# Altium schematic sheet HF_AMP_DRIVER.SchDoc: HF RF AMP DRIVER
size A4; DocumentNumber: 17; Revision: 2.0; SheetNumber: 17; SheetTotal: 18
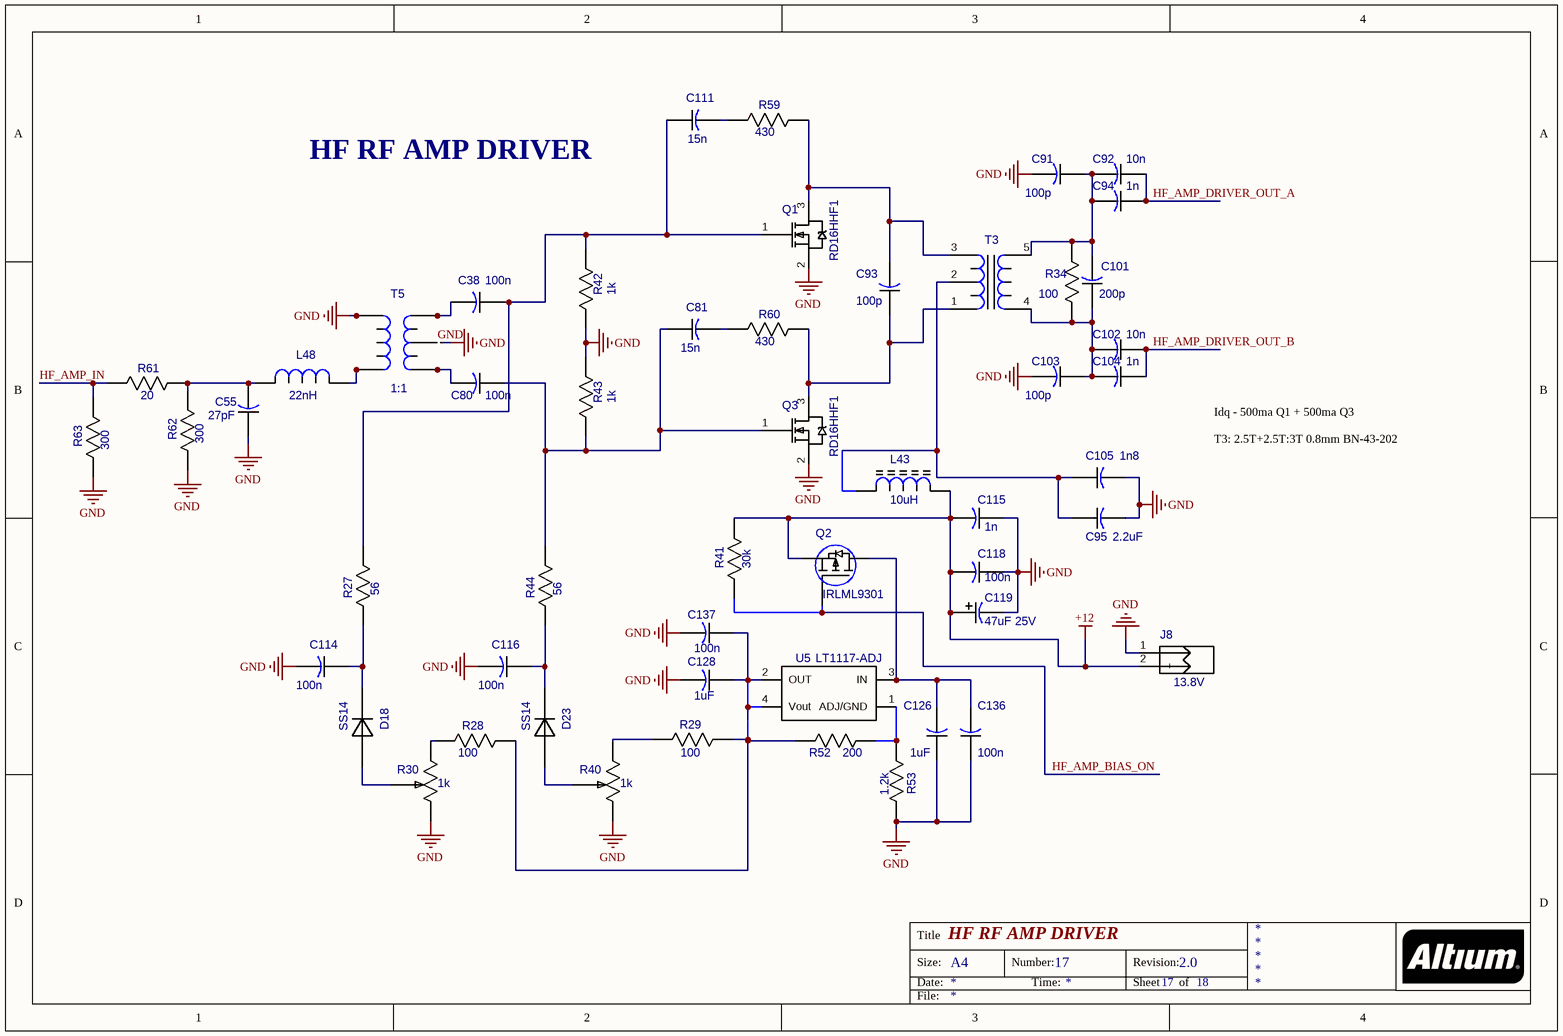
[diagram p0: HF_AMP_DRIVER.SchDoc]

## Parts
C38  100n  [CAP_0805]
C55  27pF  [CAP_0805]
C80  100n  [CAP_0805]
C81  15n  [CAP_1206]
C91  100p  [CAP_1206]
C92  10n  [CAP_1206]
C93  100p  [CAP_1206]
C94  1n  [CAP_1206]
C95  2.2uF  [CAP_1206]
C101  200p  [CAP_1206]
C102  10n  [CAP_1206]
C103  100p  [CAP_1206]
C104  1n  [CAP_1206]
C105  1n8  [CAP_1206]
C111  15n  [CAP_1206]
C114  100n  [CAP_0805]
C115  1n  [CAP_0805]
C116  100n  [CAP_0805]
C118  100n  [CAP_0805]
C119  47uF 25V  [CAPAE_6.6x6.6h5.4]
C126  1uF  [CAP_0805]
C128  1uF  [CAP_0805]
C136  100n  [CAP_0805]
C137  100n  [CAP_0805]
D18  SS14  [SS14]
D23  SS14  [SS14]
J8  13.8V  [1986717-2]
L43  10uH  [IND_FERRITE_CORE]
L48  22nH  [IND_0805]
Q1  RD16HHF1  [RD16_V2]
Q2  IRLML9301  [SOT23]
Q3  RD16HHF1  [RD16_V2]
R27  56  [RES_0805]
R28  100  [RES_0805]
R29  100  [RES_0805]
R30  value 1k  [306J]  (hidden comment: ADJ-1k)
R34  100  [RES_1206]
R40  value 1k  [306J]  (hidden comment: ADJ-1k)
R41  30k  [RES_0805]
R42  1k  [RES_0805]
R43  1k  [RES_0805]
R44  56  [RES_0805]
R52  200  [RES_0805]
R53  1.2k  [RES_0805]
R59  430  [RES_1206]
R60  430  [RES_1206]
R61  20  [RES_1206]
R62  300  [RES_1206]
R63  300  [RES_1206]
T3  TRANSF_HF3  [TRANSF_HF3]  (value not drawn)
T5  1:1  [TRANSF_ACORE2]
U5  value LT1117-ADJ  [LT1117IST-ADJ]  (hidden comment: LT1117IST-ADJ)

## Nets
+12: C115.2 C118.2 C119.1(PLUS) J8.2(+) L43.2(B) Q2.2(S) R41.2
GND: C55.1 C91.2 C95.2 C103.2 C105.2 C114.2 C115.1 C116.2 C118.1 C119.2(MINUS) C126.1 C128.2 C136.1 C137.2 J8.1(-) Q1.2(S) Q3.2(S) R30.1(CCW) R40.1(CCW) R42.1 R43.2 R53.2 R62.1 R63.1 T5.2(S2) T5.4(P2) T5.8(S2) T5.11
HF_AMP_BIAS_ON: Q2.1(G) R41.1
HF_AMP_DRIVER_OUT_A: C92.1 C94.1
HF_AMP_DRIVER_OUT_B: C102.1 C104.1
HF_AMP_IN: R61.1 R63.2
NetC38_1: C38.1 C111.1 Q1.1(G) R27.2 R42.2
NetC38_2: C38.2 T5.3(S3) T5.9
NetC55_2: C55.2 L48.1 R61.2 R62.2
NetC80_1: C80.1 C81.1 Q3.1(G) R43.1 R44.2
NetC80_2: C80.2 T5.1(S1) T5.7
NetC81_2: C81.2 R60.1
NetC91_1: C91.1 C92.2 C94.2 C101.2 R34.2 T3.5(P1)
NetC93_1: C93.1 Q3.3(D) R60.2 T3.1(S2)
NetC93_2: C93.2 Q1.3(D) R59.2 T3.3(S1)
NetC95_1: C95.1 C105.1 L43.1(A) T3.2(S3)
NetC101_1: C101.1 C102.2 C103.1 C104.2 R34.1 T3.4(P2)
NetC111_2: C111.2 R59.1
NetC114_1: C114.1 D18.1(K) R27.1
NetC116_1: C116.1 D23.1(K) R44.1
NetC126_2: C126.2 C136.2 Q2.3(D) U5.3(IN)
NetC128_1: C128.1 C137.1 R28.2 R29.2 R52.1 U5.2(OUT) U5.4(Vout)
NetD18_2: D18.2(A) R30.2(W)
NetD23_2: D23.2(A) R40.2(W)
NetL48_2: L48.2 T5.6(P1) T5.10
NetR28_1: R28.1 R30.3(CW)
NetR29_1: R29.1 R40.3(CW)
NetR52_2: R52.2 R53.1 U5.1(ADJ/GND)

## Notes on the sheet
- HF RF AMP DRIVER
- Idq - 500ma Q1 + 500ma Q3
  T3: 2.5T+2.5T:3T 0.8mm BN-43-202
- Title
- Size:
- Date:
- A4
- Number:
- Time:
- Revision:
- Sheet
- of
- File:

## Library data of the parts
C38 C55 C80 C114-C116 C118 C126 C128 C136 C137 = CAP_0805
  C114 C116 C118 C136 C137: Value: 100n
  C115: Value: 1n
  C126 C128: Value: 1uF
C81 C91-C95 C101-C105 C111 = CAP_1206
C119 = CAPAE_6.6x6.6h5.4: Value: 47uF 25V
J8 = 1986717-2: JX2; Value: 13.8V
L43 = IND_FERRITE_CORE: Inductor; Value: 10uH
L48 = IND_0805
Q2 = MOSFET_ENH_PD: MOSFET; Value: IRLML9301
R27-R29 R41-R44 R52 R53 = RES_0805
  R27 R44: Value: 56
  R41: Value: 30k
  R42 R43: Value: 1k
  R52: Value: 200
  R53: Value: 1.2k
R30 R40 = 306J
R34 R59-R63 = RES_1206
T3 = TRANSF_RF3: Value: *
T5 = TRANSF_ACORE2: Value: 1:1
D18 D23 = SS14: Value: SS14
Q1 Q3 = RD16HHF1: Value: RD16HHF1